# Altium schematic sheet PowerboardV2.SchDoc
size A; SheetNumber: 1; SheetTotal: 2
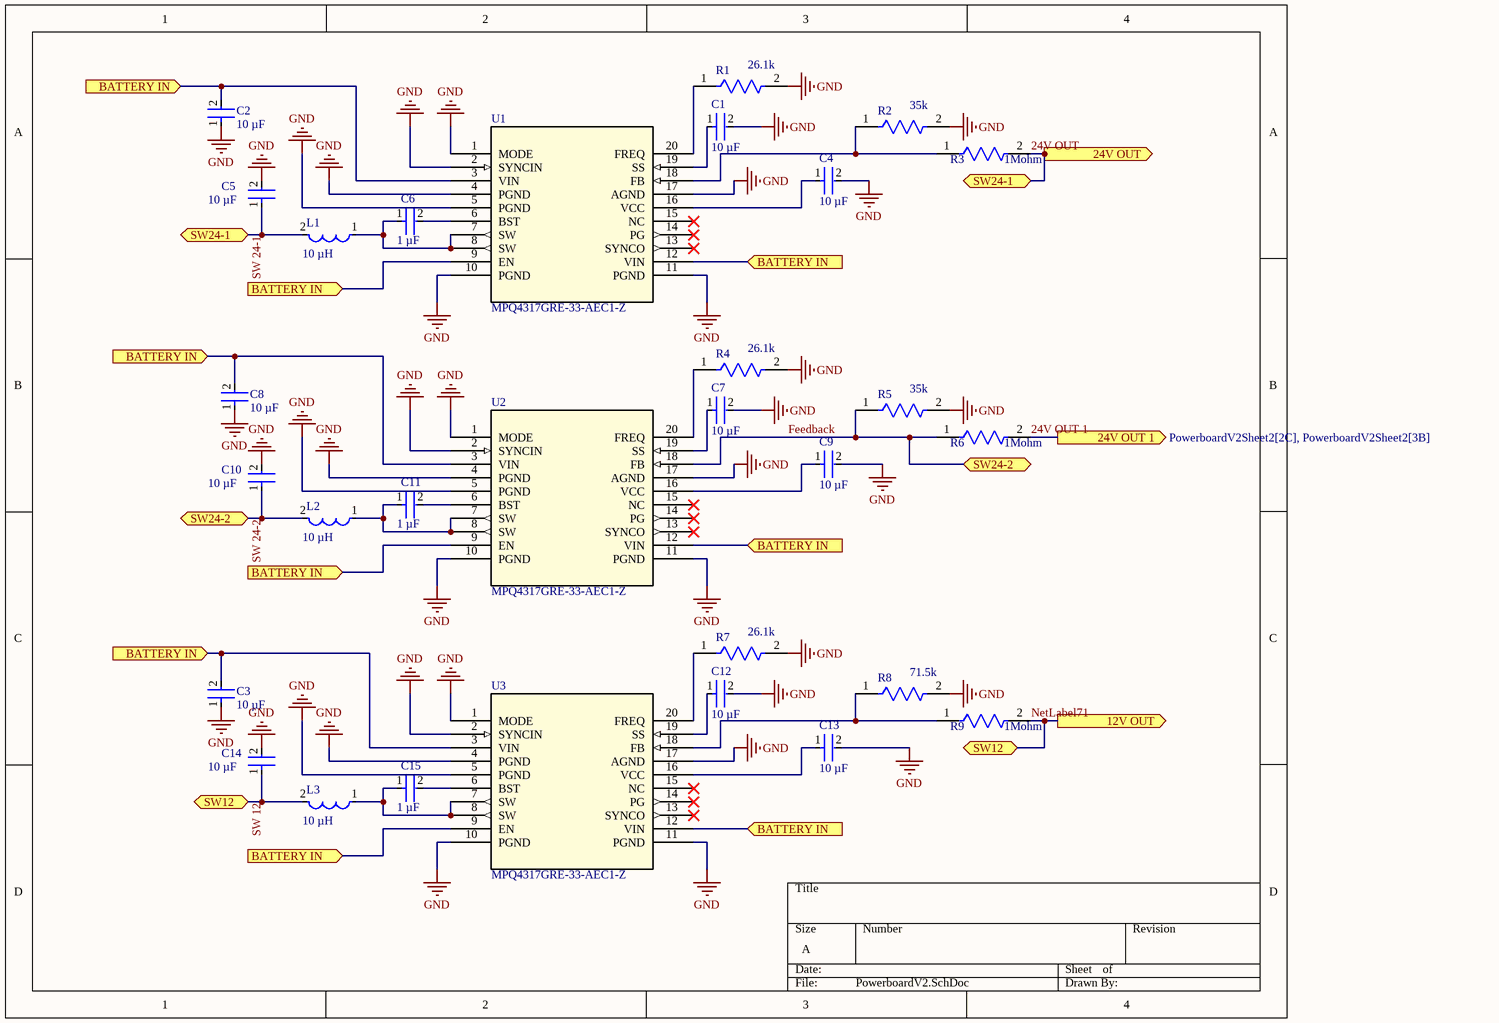
[diagram p0: PowerboardV2.SchDoc]

## Parts
C1  10 µF  [FP-C0805C-DG-MFG]
C2  10 µF  [FP-C0805C-DG-MFG]
C3  10 µF  [FP-C0805C-DG-MFG]
C4  10 µF  [FP-C0805C-DG-MFG]
C5  10 µF  [FP-C0805C-DG-MFG]
C6  1 µF  [FP-C0805C-DG-MFG]
C7  10 µF  [FP-C0805C-DG-MFG]
C8  10 µF  [FP-C0805C-DG-MFG]
C9  10 µF  [FP-C0805C-DG-MFG]
C10  10 µF  [FP-C0805C-DG-MFG]
C11  1 µF  [FP-C0805C-DG-MFG]
C12  10 µF  [FP-C0805C-DG-MFG]
C13  10 µF  [FP-C0805C-DG-MFG]
C14  10 µF  [FP-C0805C-DG-MFG]
C15  1 µF  [FP-C0805C-DG-MFG]
L1  10 µH  [FP-IHLP-5050FD-FP_2_945x4-MFG]
L2  10 µH  [FP-IHLP-5050FD-FP_2_945x4-MFG]
L3  10 µH  [FP-IHLP-5050FD-FP_2_945x4-MFG]
R1  26.1k  [FP-CRCW0805-e3-IPC_B]
R2  35k  [FP-CRCW0805-e3-IPC_B]
R3  1Mohm  [FP-CRCW0805-e3-IPC_B]
R4  26.1k  [FP-CRCW0805-e3-IPC_B]
R5  35k  [FP-CRCW0805-e3-IPC_B]
R6  1Mohm  [FP-CRCW0805-e3-IPC_B]
R7  26.1k  [FP-CRCW0805-e3-IPC_B]
R8  71.5k  [FP-CRCW0805-e3-IPC_B]
R9  1Mohm  [FP-CRCW0805-e3-IPC_B]
U1  MPQ4317GRE-33-AEC1-Z  [QFN-20_MPQ4317_MNP]
U2  MPQ4317GRE-33-AEC1-Z  [QFN-20_MPQ4317_MNP]
U3  MPQ4317GRE-33-AEC1-Z  [QFN-20_MPQ4317_MNP]

## Ports
12V OUT (out, see PowerboardV2Sheet2[2C]), 24V OUT 1 (out, see PowerboardV2Sheet2[2C], PowerboardV2Sheet2[3B]), 24V OUT (out, see PowerboardV2Sheet2[1A], PowerboardV2Sheet2[2D]), BATTERY IN (in, see PowerboardV2[1A], PowerboardV2[1B], PowerboardV2[1C], PowerboardV2[1D], PowerboardV2[3B], PowerboardV2[3C], PowerboardV2[3D], PowerboardV2Sheet2[1C], PowerboardV2Sheet2[2D], PowerboardV2Sheet2[3D]), BATTERY IN (in, see PowerboardV2[1A], PowerboardV2[1B], PowerboardV2[1C], PowerboardV2[1D], PowerboardV2[3B], PowerboardV2[3C], PowerboardV2Sheet2[1C], PowerboardV2Sheet2[2D], PowerboardV2Sheet2[3D]), BATTERY IN (in, see PowerboardV2[1A], PowerboardV2[1B], PowerboardV2[1C], PowerboardV2[1D], PowerboardV2[3B], PowerboardV2[3D], PowerboardV2Sheet2[1C], PowerboardV2Sheet2[2D], PowerboardV2Sheet2[3D]), BATTERY IN (in, see PowerboardV2[1A], PowerboardV2[1B], PowerboardV2[1C], PowerboardV2[1D], PowerboardV2[3C], PowerboardV2[3D], PowerboardV2Sheet2[1C], PowerboardV2Sheet2[2D], PowerboardV2Sheet2[3D]), BATTERY IN (in, see PowerboardV2[1A], PowerboardV2[1B], PowerboardV2[1C], PowerboardV2[3B], PowerboardV2[3C], PowerboardV2[3D], PowerboardV2Sheet2[1C], PowerboardV2Sheet2[2D], PowerboardV2Sheet2[3D]), BATTERY IN (in, see PowerboardV2[1B], PowerboardV2[1C], PowerboardV2[1D], PowerboardV2[3B], PowerboardV2[3C], PowerboardV2[3D], PowerboardV2Sheet2[1C], PowerboardV2Sheet2[2D], PowerboardV2Sheet2[3D]), SW12 (bidir, see PowerboardV2[1D]), SW12 (bidir, see PowerboardV2[3C]), SW24-1 (bidir, see PowerboardV2[1A]), SW24-1 (bidir, see PowerboardV2[3A]), SW24-2 (bidir, see PowerboardV2[1C]), SW24-2 (bidir, see PowerboardV2[3B])

## Nets
GND: C1.2 C2.1 C3.1 C4.2 C5.2 C7.2 C8.1 C9.2 C10.2 C12.2 C13.2 C14.2 R1.2 R2.2 R4.2 R5.2 R7.2 R8.2 U1.1(MODE) U1.2(SYNCIN) U1.4(PGND) U1.5(PGND) U1.10(PGND) U1.11(PGND) U1.17(AGND) U2.1(MODE) U2.2(SYNCIN) U2.4(PGND) U2.5(PGND) U2.10(PGND) U2.11(PGND) U2.17(AGND) U3.1(MODE) U3.2(SYNCIN) U3.4(PGND) U3.5(PGND) U3.10(PGND) U3.11(PGND) U3.17(AGND)
24V OUT: C5.1 L1.2 R3.2 ; port 24V OUT, port SW24-1  [also labelled SW 24-1]
24V OUT 1: R6.2 ; port 24V OUT 1
BATTERY IN: C2.2 C3.2 C8.2 U1.3(VIN) U1.9(EN) U1.12(VIN) U2.3(VIN) U2.9(EN) U2.12(VIN) U3.3(VIN) U3.9(EN) U3.12(VIN) ; port BATTERY IN
Feedback: C10.1 L2.2 R5.1 R6.1 U2.18(FB) ; port SW24-2  [also labelled SW 24-2]
NetLabel71: C14.1 L3.2 R9.2 ; port 12V OUT, port SW12  [also labelled SW 12]
NetC1_1: C1.1 U1.19(SS)
NetC4_1: C4.1 U1.16(VCC)
NetC6_1: C6.1 L1.1 U1.7(SW) U1.8(SW)
NetC6_2: C6.2 U1.6(BST)
NetC7_1: C7.1 U2.19(SS)
NetC9_1: C9.1 U2.16(VCC)
NetC11_1: C11.1 L2.1 U2.7(SW) U2.8(SW)
NetC11_2: C11.2 U2.6(BST)
NetC12_1: C12.1 U3.19(SS)
NetC13_1: C13.1 U3.16(VCC)
NetC15_1: C15.1 L3.1 U3.7(SW) U3.8(SW)
NetC15_2: C15.2 U3.6(BST)
NetR1_1: R1.1 U1.20(FREQ)
NetR2_1: R2.1 R3.1 U1.18(FB)
NetR4_1: R4.1 U2.20(FREQ)
NetR7_1: R7.1 U3.20(FREQ)
NetR8_1: R8.1 R9.1 U3.18(FB)

Not connected (* = marked no-connect by the designer): U1 13(SYNCO)* 14(PG)* 15(NC)*; U2 13(SYNCO)* 14(PG)* 15(NC)*; U3 13(SYNCO)* 14(PG)* 15(NC)*

## Library data of the parts
C1-C15 = CMP-2007-03243-2: CAP CER 10UF 10V X5R 0805; Manufacturer Part Number: C0805C106K8PACTU; Manufacturer: Kemet; 3DS Part Number: 220-00001; Tolerance: 10%; Temperature Coefficient: 15%; Material: Ceramic; Device Class L2: Capacitors; Device Class L1: Passive Components; ComponentLink2URL: https://content.kemet.com/datasheets/KEM_C1006_X5R_SMD.pdf; Height: 1.4mm; Lead Free: Yes; Digikey Description: CAP CER 10UF 10V X5R 0805; Octopart: https://octopart.com/c0805c106k8pactu-kemet-98697; Capacitance: 10uF; Value: 10uF; Temperature Range Low: -55°C; Temperature: -55°C to +85°C; Automotive: No; Mouser Description: CAP CER 10UF 10V X5R 0805; Ipc Land Pattern Name: CAPC200125X125; Temperature Range High: +85°C; Voltage: 10V; RoHS: TRUE; Device Class L3: Ceramic Capacitors; ComponentLink2Description: Datasheet; Voltage Rating: 10V; Package: C0805C-DG; Temperature Characteristic: X5R; Category: Cap
L1-L3 = CMP-02424-000485-1: FIXED IND 10UH 10A 17.2 MOHM SMD; Core Material: Metal; Self Resonant Frequency: 5MHz; Test Frequency: 100kHz; Shielding: Shielded; Max DC Current: 15.5A; DC Resistance (DCR): 17.2mR; Tolerance: 20%; Package Quantity: 250; Lead Free: Lead Free; RMS Current (Irms): 10A; Contact Plating: Tin; Max Operating Temperature: 125°C; Height - Seated (Max): 0.256inch; Case/Package: 5050; Military Standard: Not; Termination: SMD/SMT; Width: 0.508inch; Mount: Surface Mount; Inductance: 10uH; Number of Pins: 2; Packaging: Tape and Reel; Height: 6.5mm; Depth: 12.9mm; Radiation Hardening: No; Min Operating Temperature: -55°C; Length: 13.7mm; Current Rating: 10A; Inductance Tolerance: 20%; Saturation Current: 15.5A
R1-R9 = CMP-2001-03630-2: RES Thick Film, 1MΩ, 1%, 0.125W, 100ppm/°C, 0805; Voltage Rating (DC): 150V; Resistance: 1MR; Power Rating: 125mW; Packaging: Tape and Reel; Case Code (Metric): 2012; Case/Package: 0805; Width: 1.25mm; Mount: Surface Mount; Military Standard: Not; Radiation Hardening: No; Weight: 0.000194oz; Package Quantity: 5000; Max Operating Temperature: 155°C; Contact Plating: Tin; Composition: Thick Film; Number of Pins: 2; Tolerance: 1%; Termination: SMD/SMT; Case Code (Imperial): 0805; Depth: 1.25mm; Temperature Coefficient: 100ppm/°C; Min Operating Temperature: -55°C; Height: 0.45mm; Lead Free: Lead Free; Length: 2mm; Voltage Rating: 150V
U1-U3 = MPQ4317GRE-33-AEC1-Z: No Description Available; Mfr_Name: Monolithic Power Systems; Copyright: Copyright (C) 2023 Ultra Librarian. All rights reserved.; Manufacturer_Part_Number: MPQ4317GRE-33-AEC1-Z; RefDes: RefDes; Type: Type